# Altium schematic sheet Sheet1.SchDoc
size A2
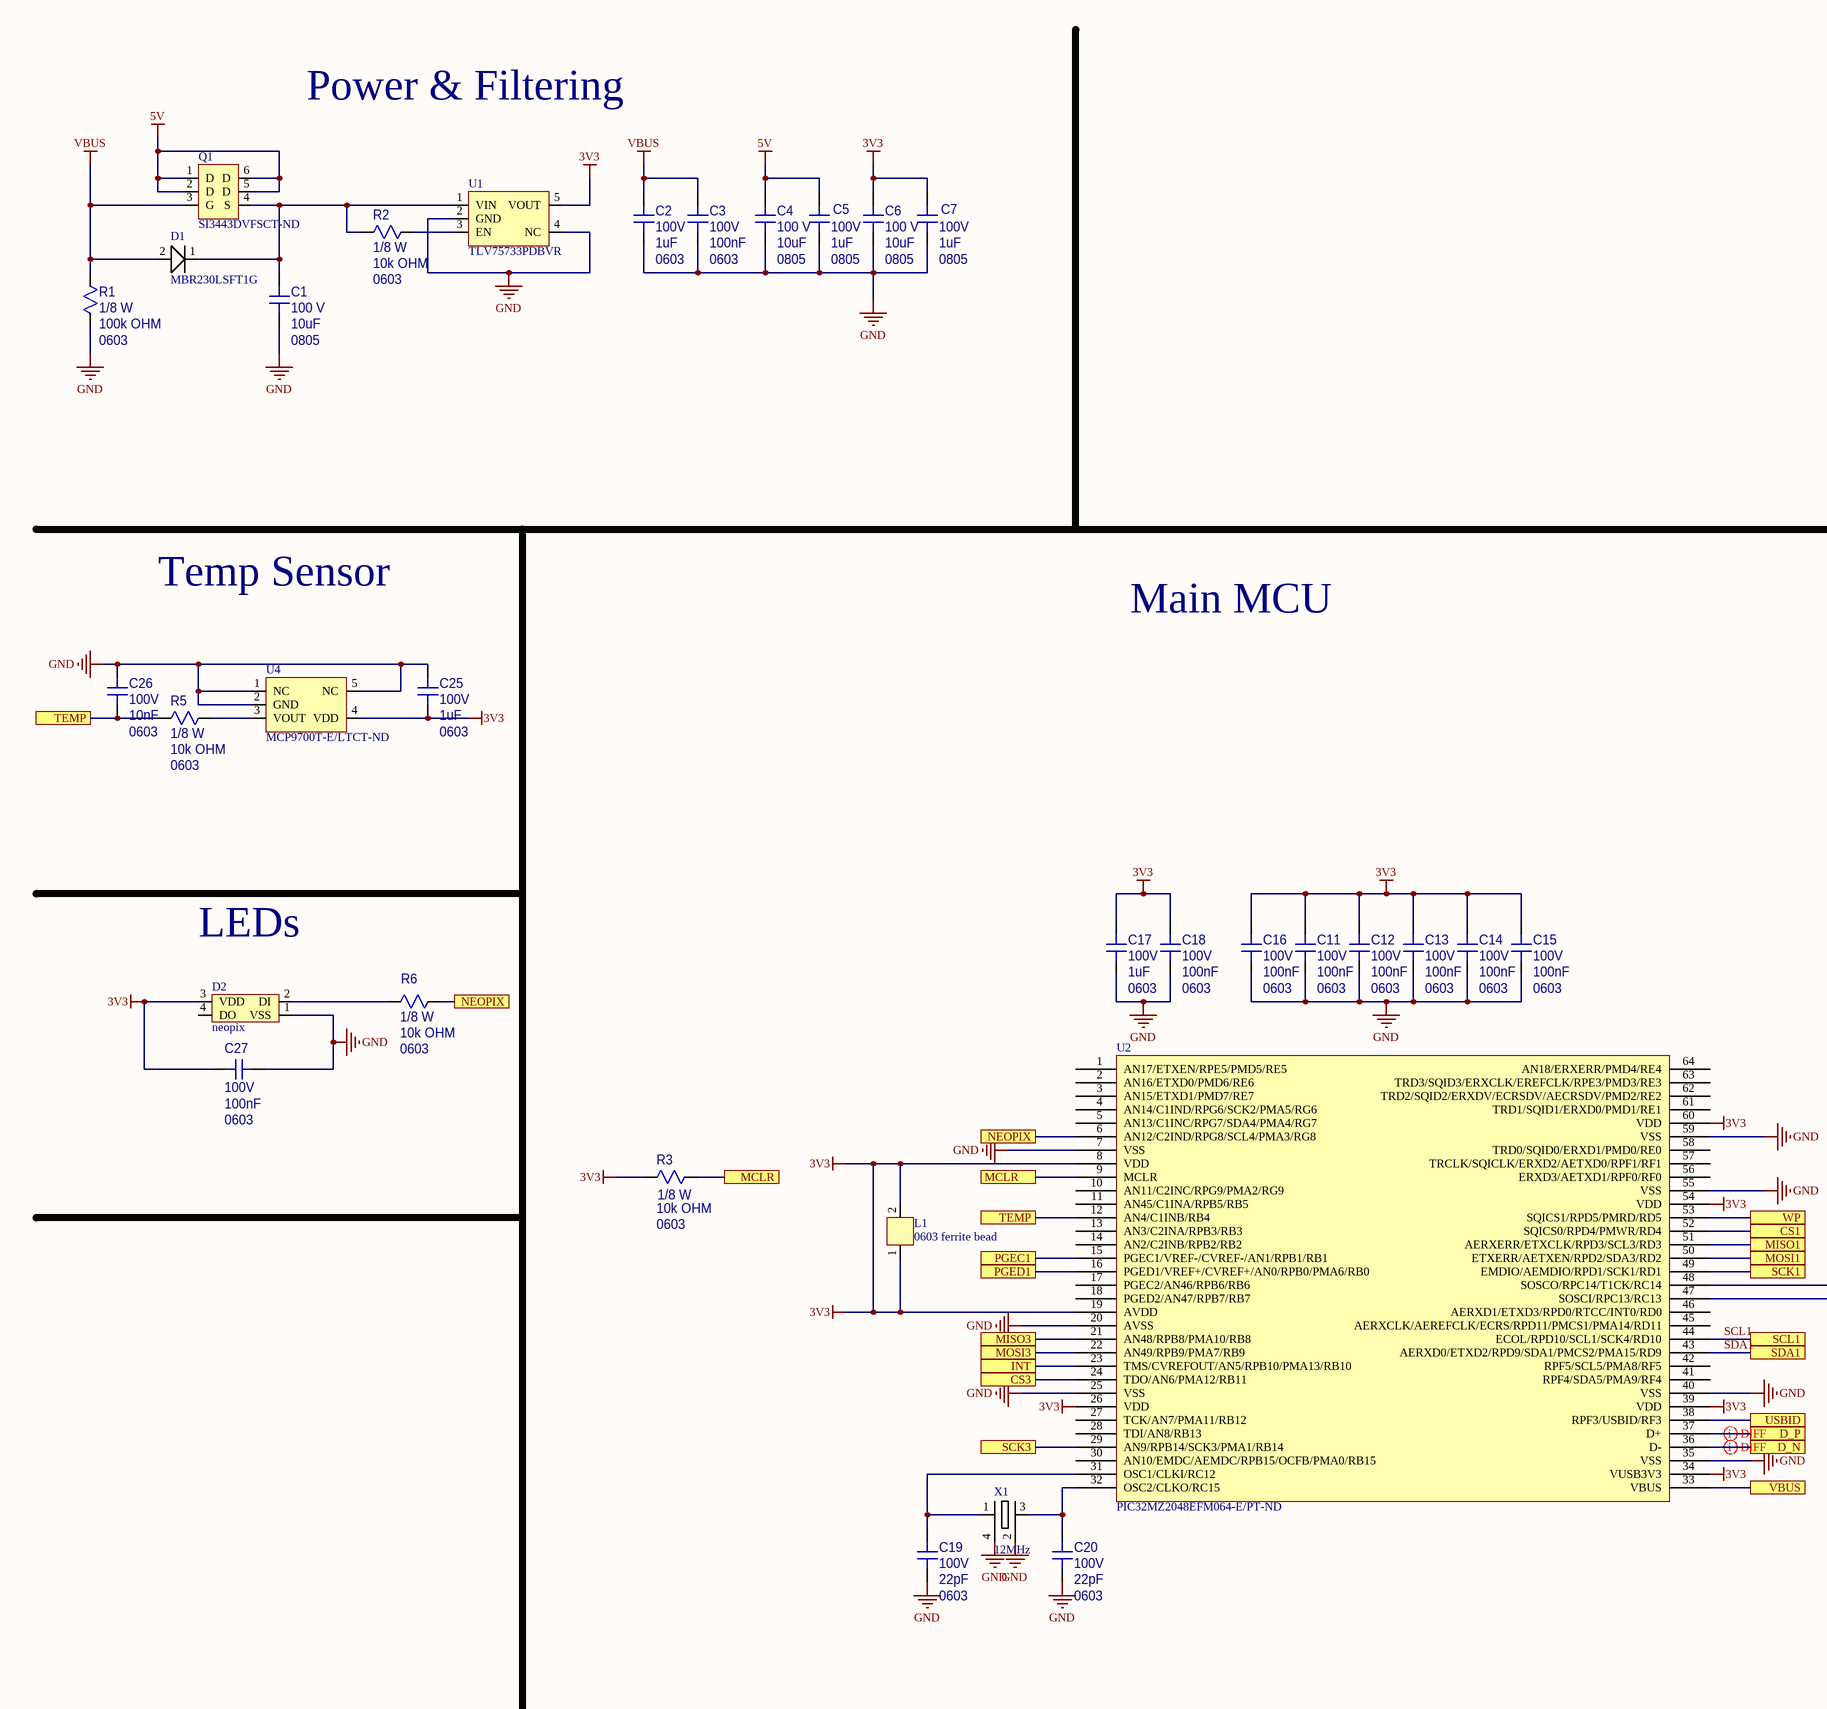
[diagram p0: Sheet1.SchDoc, left]
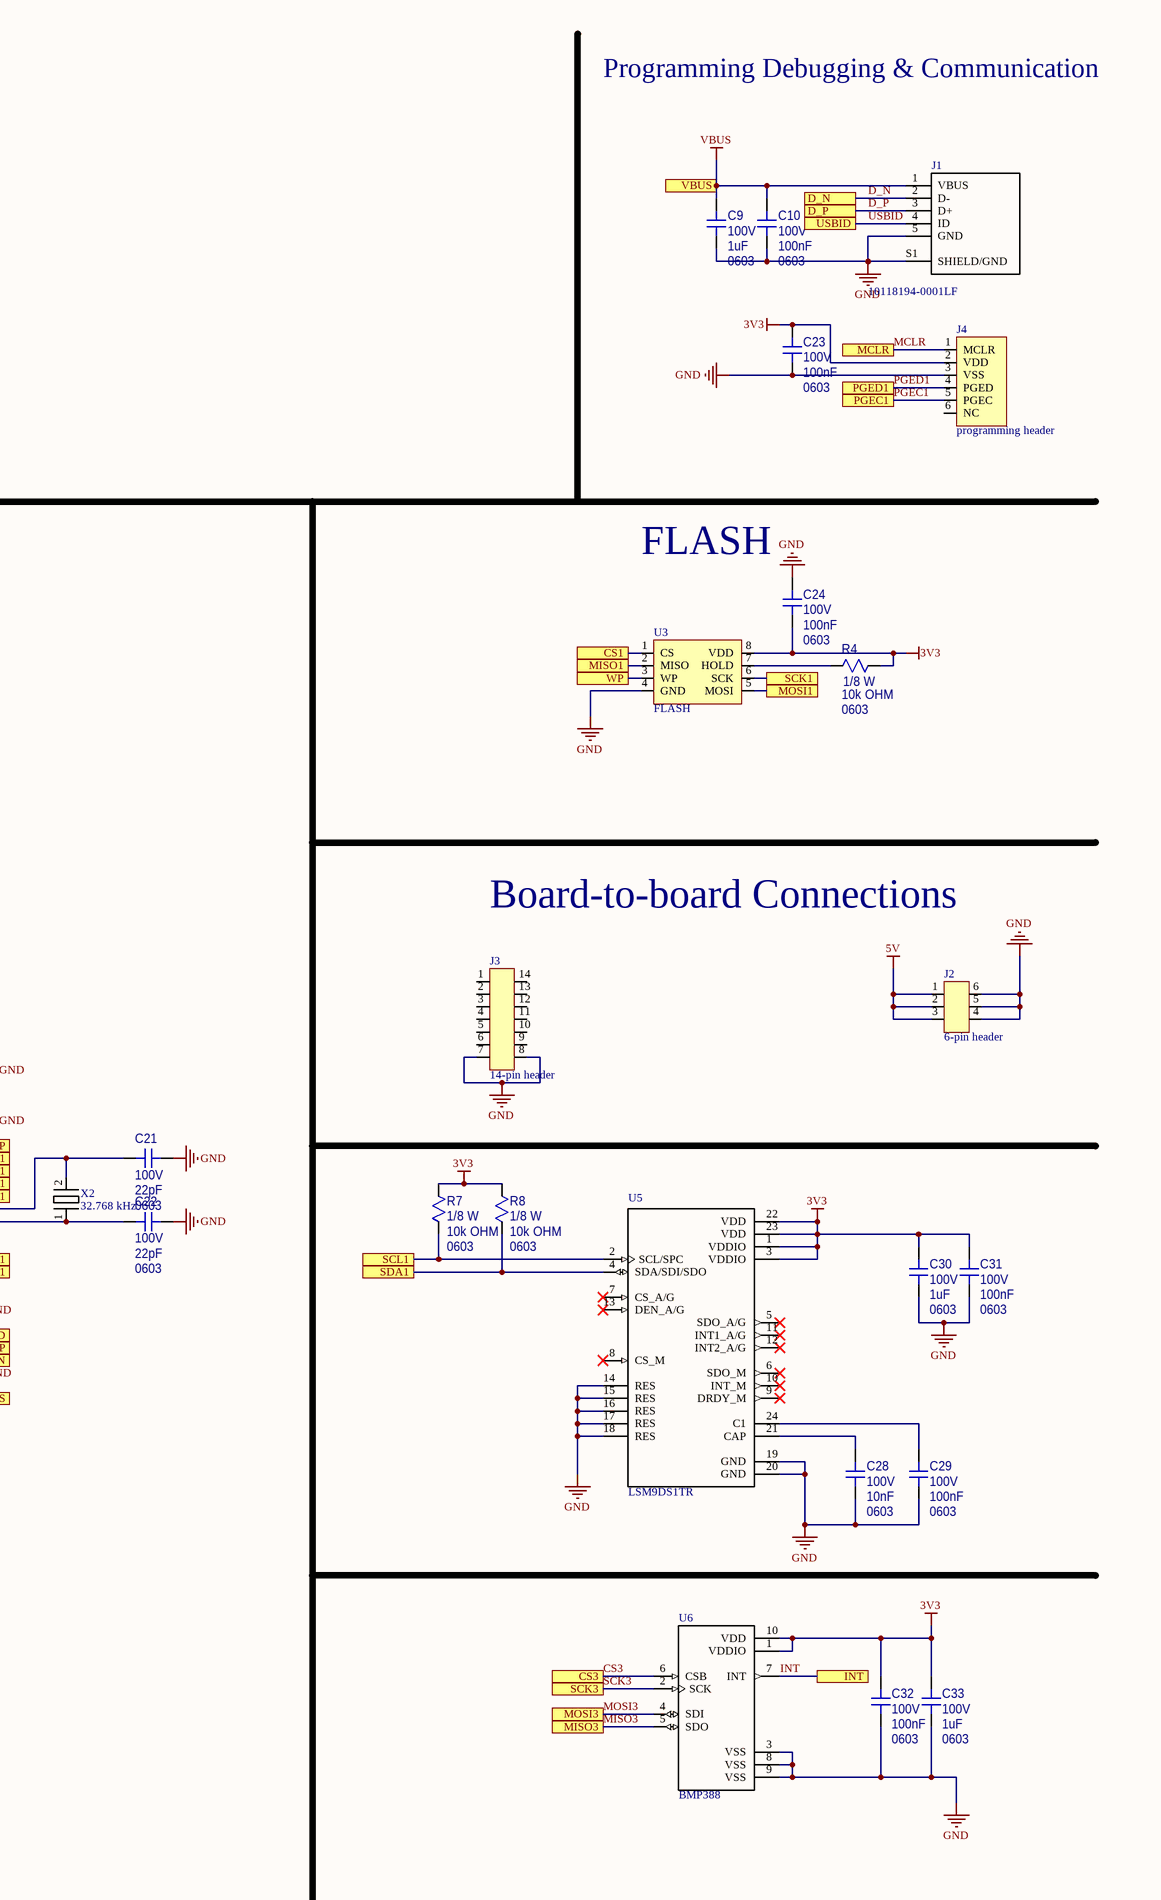
[diagram p1: Sheet1.SchDoc, right]

## Parts
C1  value 10uF  Voltage: 100 V  Size: 0805  [0805C (reflow)]  (hidden comment: Capacitor)
C2  value 1uF  Voltage: 100V  Size: 0603  [0603C (reflow)]  (hidden comment: Capacitor)
C3  value 100nF  Voltage: 100V  Size: 0603  [0603C (reflow)]  (hidden comment: Capacitor)
C4  value 10uF  Voltage: 100 V  Size: 0805  [0805C (reflow)]  (hidden comment: Capacitor)
C5  value 1uF  Voltage: 100V  Size: 0805  [0805C (reflow)]  (hidden comment: Capacitor)
C6  value 10uF  Voltage: 100 V  Size: 0805  [0805C (reflow)]  (hidden comment: Capacitor)
C7  value 1uF  Voltage: 100V  Size: 0805  [0805C (reflow)]  (hidden comment: Capacitor)
C9  value 1uF  Voltage: 100V  Size: 0603  [0603C (reflow)]  (hidden comment: Capacitor)
C10  value 100nF  Voltage: 100V  Size: 0603  [0603C (reflow)]  (hidden comment: Capacitor)
C11  value 100nF  Voltage: 100V  Size: 0603  [0603C (reflow)]  (hidden comment: Capacitor)
C12  value 100nF  Voltage: 100V  Size: 0603  [0603C (reflow)]  (hidden comment: Capacitor)
C13  value 100nF  Voltage: 100V  Size: 0603  [0603C (reflow)]  (hidden comment: Capacitor)
C14  value 100nF  Voltage: 100V  Size: 0603  [0603C (reflow)]  (hidden comment: Capacitor)
C15  value 100nF  Voltage: 100V  Size: 0603  [0603C (reflow)]  (hidden comment: Capacitor)
C16  value 100nF  Voltage: 100V  Size: 0603  [0603C (reflow)]  (hidden comment: Capacitor)
C17  value 1uF  Voltage: 100V  Size: 0603  [0603C (reflow)]  (hidden comment: Capacitor)
C18  value 100nF  Voltage: 100V  Size: 0603  [0603C (reflow)]  (hidden comment: Capacitor)
C19  value 22pF  Voltage: 100V  Size: 0603  [0603C (reflow)]  (hidden comment: Capacitor)
C20  value 22pF  Voltage: 100V  Size: 0603  [0603C (reflow)]  (hidden comment: Capacitor)
C21  value 22pF  Voltage: 100V  Size: 0603  [0603C (reflow)]  (hidden comment: Capacitor)
C22  value 22pF  Voltage: 100V  Size: 0603  [0603C (reflow)]  (hidden comment: Capacitor)
C23  value 100nF  Voltage: 100V  Size: 0603  [0603C (reflow)]  (hidden comment: Capacitor)
C24  value 100nF  Voltage: 100V  Size: 0603  [0603C (reflow)]  (hidden comment: Capacitor)
C25  value 1uF  Voltage: 100V  Size: 0603  [0603C (reflow)]  (hidden comment: Capacitor)
C26  value 10nF  Voltage: 100V  Size: 0603  [0603C (reflow)]  (hidden comment: Capacitor)
C27  value 100nF  Voltage: 100V  Size: 0603  [0603C (reflow)]  (hidden comment: Capacitor)
C28  value 10nF  Voltage: 100V  Size: 0603  [0603C (reflow)]  (hidden comment: Capacitor)
C29  value 100nF  Voltage: 100V  Size: 0603  [0603C (reflow)]  (hidden comment: Capacitor)
C30  value 1uF  Voltage: 100V  Size: 0603  [0603C (reflow)]  (hidden comment: Capacitor)
C31  value 100nF  Voltage: 100V  Size: 0603  [0603C (reflow)]  (hidden comment: Capacitor)
C32  value 100nF  Voltage: 100V  Size: 0603  [0603C (reflow)]  (hidden comment: Capacitor)
C33  value 1uF  Voltage: 100V  Size: 0603  [0603C (reflow)]  (hidden comment: Capacitor)
D1  MBR230LSFT1G  [MBR230LSFT1G]
D2  neopix  [neopix]
J1  10118194-0001LF  [*AMPHENOL_10118194-0001LF_10118194-0001LF(Primary)]
J2  6-pin header  [6-pin header]
J3  14-pin header  [14-pin header]
J4  programming header  [programming header]
L1  0603 ferrite bead  [0603R (reflow)]
Q1  SI3443DVFSCT-ND  [SI3443DVFSCT-ND]
R1  value 100k OHM  Power: 1/8 W  Size: 0603  [0603R (reflow)]  (hidden comment: Resistor)
R2  value 10k OHM  Power: 1/8 W  Size: 0603  [0603R (reflow)]  (hidden comment: Resistor)
R3  value 10k OHM  Power: 1/8 W  Size: 0603  [0603R (reflow)]  (hidden comment: Resistor)
R4  value 10k OHM  Power: 1/8 W  Size: 0603  [0603R (reflow)]  (hidden comment: Resistor)
R5  value 10k OHM  Power: 1/8 W  Size: 0603  [0603R (reflow)]  (hidden comment: Resistor)
R6  value 10k OHM  Power: 1/8 W  Size: 0603  [0603R (reflow)]  (hidden comment: Resistor)
R7  value 10k OHM  Power: 1/8 W  Size: 0603  [0603R (reflow)]  (hidden comment: Resistor)
R8  value 10k OHM  Power: 1/8 W  Size: 0603  [0603R (reflow)]  (hidden comment: Resistor)
U1  TLV75733PDBVR  [SOT23-5N]
U2  PIC32MZ2048EFM064-E/PT-ND  [TQFP-64]
U3  FLASH  [8-SOIC]
U4  MCP9700T-E/LTCT-ND  [MCP9700T-E/LT]
U5  LSM9DS1TR  [*PQFN43P300X350X102-24N]
U6  BMP388  [*PQFN50P200X200X80-10N]
X1  12MHz  [XC2731CT-ND]
X2  32.768 kHz  [XC2292CT-ND]

## Ports
CS1, CS3, D_N, D_P, INT, MCLR, MISO1, MISO3, MOSI1, MOSI3, NEOPIX, PGEC1, PGED1, SCK1, SCK3, SCL1, SDA1, TEMP, USBID, VBUS, WP

## Nets
3V3: C6.1 C7.1 C11.1 C12.1 C13.1 C14.1 C15.1 C16.1 C17.1 C18.1 C23.1 C24.2 C25.2 C27.1 C30.1 C31.2 C32.2 C33.2 D2.3(VDD) J4.2(VDD) L1.1 L1.2 R3.1 R4.2 R7.2 R8.2 U1.5(VOUT) U2.8(VDD) U2.19(AVDD) U2.26(VDD) U2.34(VUSB3V3) U2.39(VDD) U2.54(VDD) U2.60(VDD) U3.8(VDD) U4.4(VDD) U5.1(VDDIO) U5.3(VDDIO) U5.22(VDD) U5.23(VDD) U6.1(VDDIO) U6.10(VDD)
5V: C4.1 C5.1 J2.1 J2.2 J2.3 Q1.1(D) Q1.2(D) Q1.5(D) Q1.6(D)
GND: C1.2 C2.2 C3.2 C4.2 C5.2 C6.2 C7.2 C9.2 C10.2 C11.2 C12.2 C13.2 C14.2 C15.2 C16.2 C17.2 C18.2 C19.2 C20.2 C21.2 C22.2 C23.2 C24.1 C25.1 C26.1 C27.2 C28.1 C29.1 C30.2 C31.1 C32.1 C33.1 D2.1(VSS) J1.5(GND) J1.S1(SHIELD/GND) J2.4 J2.5 J2.6 J3.7 J3.8 J4.3(VSS) R1.1 U1.2(GND) U1.4(NC) U2.7(VSS) U2.20(AVSS) U2.25(VSS) U2.35(VSS) U2.40(VSS) U2.55(VSS) U2.59(VSS) U3.4(GND) U4.1(NC) U4.2(GND) U4.5(NC) U5.14(RES) U5.15(RES) U5.16(RES) U5.17(RES) U5.18(RES) U5.19(GND) U5.20(GND) U6.3(VSS) U6.8(VSS) U6.9(VSS) X1.2 X1.4
VBUS: C2.1 C3.1 C9.1 C10.1 D1.2 J1.1(VBUS) Q1.3(G) R1.2 U2.33(VBUS) ; port VBUS
CS1: U2.52(SQICS0/RPD4/PMWR/RD4) U3.1(CS) ; port CS1
CS3: U2.24(TDO/AN6/PMA12/RB11) U6.6(CSB) ; port CS3
D_N: J1.2(D-) U2.36(D-) ; port D_N
D_P: J1.3(D+) U2.37(D+) ; port D_P
INT: U2.23(TMS/CVREFOUT/AN5/RPB10/PMA13/RB10) U6.7(INT) ; port INT
MCLR: J4.1(MCLR) R3.2 U2.9(MCLR) ; port MCLR
MISO1: U2.51(AERXERR/ETXCLK/RPD3/SCL3/RD3) U3.2(MISO) ; port MISO1
MISO3: U2.21(AN48/RPB8/PMA10/RB8) U6.5(SDO) ; port MISO3
MOSI1: U2.50(ETXERR/AETXEN/RPD2/SDA3/RD2) U3.5(MOSI) ; port MOSI1
MOSI3: U2.22(AN49/RPB9/PMA7/RB9) U6.4(SDI) ; port MOSI3
NEOPIX: R6.1 U2.6(AN12/C2IND/RPG8/SCL4/PMA3/RG8) ; port NEOPIX
PGEC1: J4.5(PGEC) U2.15(PGEC1/VREF-/CVREF-/AN1/RPB1/RB1) ; port PGEC1
PGED1: J4.4(PGED) U2.16(PGED1/VREF+/CVREF+/AN0/RPB0/PMA6/RB0) ; port PGED1
SCK1: U2.49(EMDIO/AEMDIO/RPD1/SCK1/RD1) U3.6(SCK) ; port SCK1
SCK3: U2.29(AN9/RPB14/SCK3/PMA1/RB14) U6.2(SCK) ; port SCK3
SCL1: R7.1 U2.44(ECOL/RPD10/SCL1/SCK4/RD10) U5.2(SCL/SPC) ; port SCL1
SDA1: R8.1 U2.43(AERXD0/ETXD2/RPD9/SDA1/PMCS2/PMA15/RD9) U5.4(SDA/SDI/SDO) ; port SDA1
TEMP: C26.2 R5.2 U2.12(AN4/C1INB/RB4) ; port TEMP
USBID: J1.4(ID) U2.38(RPF3/USBID/RF3) ; port USBID
WP: U2.53(SQICS1/RPD5/PMRD/RD5) U3.3(WP) ; port WP
NetC1_1: C1.1 D1.1 Q1.4(S) R2.2 U1.1(VIN)
NetC19_1: C19.1 U2.31(OSC1/CLKI/RC12) X1.1
NetC20_1: C20.1 U2.32(OSC2/CLKO/RC15) X1.3
NetC21_1: C21.1 U2.48(SOSCO/RPC14/T1CK/RC14) X2.2
NetC22_1: C22.1 U2.47(SOSCI/RPC13/RC13) X2.1
NetC28_2: C28.2 U5.21(CAP)
NetC29_2: C29.2 U5.24(C1)
NetD2_2: D2.2(DI) R6.2
NetR2_1: R2.1 U1.3(EN)
NetR4_1: R4.1 U3.7(HOLD)
NetR5_1: R5.1 U4.3(VOUT)

Not connected (* = marked no-connect by the designer): D2 4(DO); J3 1 2 3 4 5 6 9 10 11 12 13 14; J4 6(NC); U2 1(AN17/ETXEN/RPE5/PMD5/RE5) 2(AN16/ETXD0/PMD6/RE6) 3(AN15/ETXD1/PMD7/RE7) 4(AN14/C1IND/RPG6/SCK2/PMA5/RG6) 5(AN13/C1INC/RPG7/SDA4/PMA4/RG7) 10(AN11/C2INC/RPG9/PMA2/RG9) 11(AN45/C1INA/RPB5/RB5) 13(AN3/C2INA/RPB3/RB3) 14(AN2/C2INB/RPB2/RB2) 17(PGEC2/AN46/RPB6/RB6) 18(PGED2/AN47/RPB7/RB7) 27(TCK/AN7/PMA11/RB12) 28(TDI/AN8/RB13) 30(AN10/EMDC/AEMDC/RPB15/OCFB/PMA0/RB15) 41(RPF4/SDA5/PMA9/RF4) 42(RPF5/SCL5/PMA8/RF5) 45(AERXCLK/AEREFCLK/ECRS/RPD11/PMCS1/PMA14/RD11) 46(AERXD1/ETXD3/RPD0/RTCC/INT0/RD0) 56(ERXD3/AETXD1/RPF0/RF0) 57(TRCLK/SQICLK/ERXD2/AETXD0/RPF1/RF1) 58(TRD0/SQID0/ERXD1/PMD0/RE0) 61(TRD1/SQID1/ERXD0/PMD1/RE1) 62(_TRD2/SQID2/ERXDV/ECRSDV/AECRSDV/PMD2/RE2) 63(TRD3/SQID3/ERXCLK/EREFCLK/RPE3/PMD3/RE3) 64(AN18/ERXERR/PMD4/RE4); U5 5(SDO_A/G)* 6(SDO_M)* 7(CS_A/G)* 8(CS_M)* 9(DRDY_M)* 10(INT_M)* 11(INT1_A/G)* 12(INT2_A/G)* 13(DEN_A/G)*

## Layout directives
differential pair: D_N, D_P

## Notes on the sheet
- Power & Filtering
- Programming Debugging & Communication
- Temp Sensor
- Main MCU
- FLASH
- LEDs
- Board-to-board Connections

## Library data of the parts
C1 C4-C7 = 0805 Capacitor: Default 0805 capacitor; Digikey part #: *; Manufacturer: *
C2 C3 C9-C33 = 0603 Capacitor: Default 0603 capacitor; Digikey part #: *; Manufacturer: *
D1 = MBR230LSFT1G: Schottky 30V 2A; ComponentLink1Description: MBR230LSFT1GOSCT-ND; ComponentLink1URL: https://www.digikey.com/product-detail/en/on-semiconductor/MBR230LSFT1G/MBR230LSFT1GOSCT-ND/1967064
J1 = 10118194-0001LF: USB - micro B USB 2.0 Receptacle Connector 5 Position Surface Mount, Right Angle; Through Hole; MF: Amphenol ICC; SnapEDA_Link: https://www.snapeda.com/parts/10118194-0001LF/Amphenol%20FCI/view-part/1413308/?ref=snap; Digi-Key_Part_Number: 609-4618-1-ND; Digi-Key_Purchase_URL: https://www.digikey.com/product-detail/en/amphenol-icc-fci/10118194-0001LF/609-4618-1-ND/2785382?utm_source=snapeda&utm_medium=aggregator&utm_campaign=symbol; MP: 10118194-0001LF; Package: None; Value: *; ComponentLink1Description: 10118194-0001LF; ComponentLink1URL: https://www.digikey.com/product-detail/en/amphenol-icc-fci/10118194-0001LF/609-4618-1-ND/2785382
R1-R8 = 0603 Resistor: Default 0603 resistor; Digikey part #: *; Manufacturer: *
U3 = MB85RS64V: ComponentLink1Description: MB85RS64V; ComponentLink1URL: https://www.digikey.com/product-detail/en/fujitsu-electronics-america-inc/MB85RS64VPNF-G-JNERE1/865-1260-1-ND/4022676
U4 = MCP9700T-E/LTCT-ND: Temp sens; ComponentLink1Description: MCP9700T-E/LTCT-ND; ComponentLink1URL: https://www.digikey.com/product-detail/en/microchip-technology/MCP9700T-E-LT/MCP9700T-E-LTCT-ND/736010
U5 = LSM9DS1TR: / Accelerometer, Gyroscope, Magnetometer, Temperature, 9 Axis Sensor I虏C, SPI Output /; MF: STMicroelectronics; MP: LSM9DS1TR; Package: TFLGA-24 STMicroelectronics; Digi-Key_Purchase_URL: https://www.digikey.com/product-detail/en/stmicroelectronics/LSM9DS1TR/497-14946-1-ND/4988079?utm_source=snapeda&utm_medium=aggregator&utm_campaign=symbol; SnapEDA_Link: https://www.snapeda.com/parts/LSM9DS1TR/STMicroelectronics/view-part/106273/?ref=snap; Digi-Key_Part_Number: 497-14946-1-ND; Value: *
U6 = BMP388: Pressure Sensor 4.35PSI ~ 18.13PSI _30kPa ~ 125kPa_ Absolute 10-WFLGA; MF: Bosch Sensortec; Digi-Key_Purchase_URL: https://www.digikey.com/product-detail/en/bosch-sensortec/BMP388/828-1079-1-ND/8322640?utm_source=snapeda&utm_medium=aggregator&utm_campaign=symbol; Digi-Key_Part_Number: 828-1079-1-ND; Package: WFLGA-10 Bosch Tools; SnapEDA_Link: https://www.snapeda.com/parts/BMP388/Bosch%20Sensortec/view-part/2747857/?ref=snap; MP: BMP388; Value: *
X1 = XC2731CT-ND: ComponentLink1Description: XC2731CT-ND; ComponentLink1URL: https://www.digikey.com/product-detail/en/ecs-inc/ECS-120-20-30B-AGL-TR/XC2731CT-ND/8023666
X2 = XC2292CT-ND: ComponentLink1Description: XC2292CT-ND; ComponentLink1URL: https://www.digikey.com/product-detail/en/ecs-inc/ECX-327-CDX-1293/XC2292CT-ND/6821660
Q1 = SI3443DVFSCT-ND: ComponentLink1Description: SI3443DVFSCT-ND; ComponentLink1URL: https://www.digikey.com/product-detail/en/on-semiconductor/SI3443DV/SI3443DVFSCT-ND/1627060
U1 = TLV75733PDBVR: ComponentLink1Description: TLV75733PDBVR; ComponentLink1URL: https://www.digikey.com/product-detail/en/texas-instruments/TLV75733PDBVR/296-50414-1-ND/9685553
U2 = PIC32MZ2048EFM064-E/PT-ND: ComponentLink1Description: PIC32MZ2048EFM064-E/PT-ND; ComponentLink1URL: https://www.digikey.com/product-detail/en/microchip-technology/PIC32MZ2048EFM064-E-PT/PIC32MZ2048EFM064-E-PT-ND/5323570